# Altium schematic sheet FAN_CTRL.SchDoc
size A4
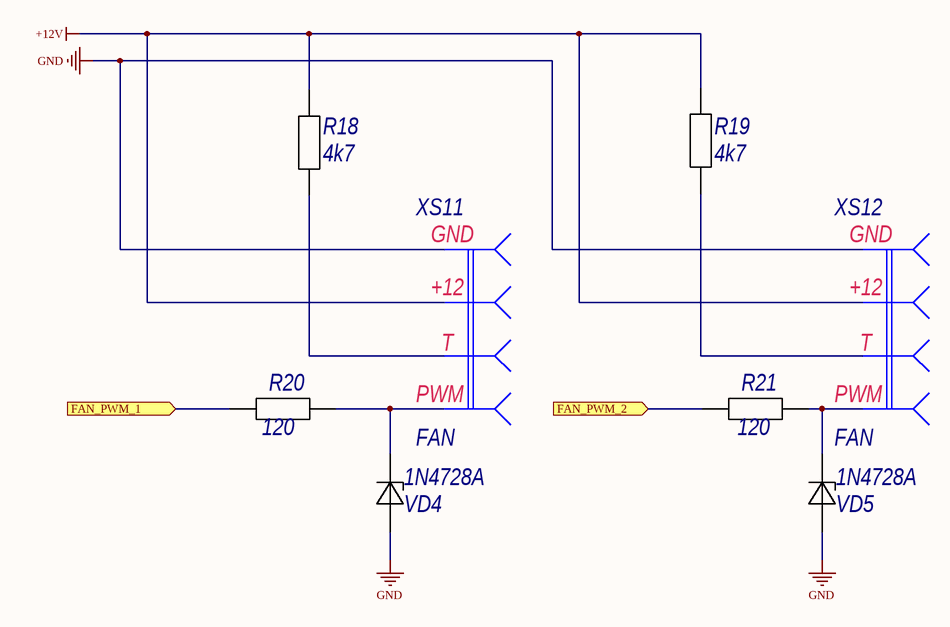
[diagram p0: FAN_CTRL.SchDoc]

## Parts
R18  4k7  [C0805R]
R19  4k7  [C0805R]
R20  120  [C0805R]
R21  120  [C0805R]
VD4  1N4728A  [DO-41]
VD5  1N4728A  [DO-41]
XS11  FAN  [PLD1X4]
XS12  FAN  [PLD1X4]

## Ports
FAN_PWM_1 (in), FAN_PWM_2 (in)

## Nets
+12V: R18.2 R19.2 XS11.2 XS12.2
GND: VD4.1(А) VD5.1(А) XS11.1 XS12.1
FAN_PWM_1: R20.1 ; port FAN_PWM_1
FAN_PWM_2: R21.1 ; port FAN_PWM_2
NetR18_1: R18.1 XS11.3
NetR19_1: R19.1 XS12.3
NetR20_2: R20.2 VD4.2(К) XS11.4
NetR21_2: R21.2 VD5.2(К) XS12.4

## Notes on the sheet
- (in symbol FAN_CON) GND; +12; T; PWM

## Library data of the parts
R18-R21 = RES_0805: Published: 24.03.2010; Publisher: Andrew Danich; Type: Резистор
VD4 VD5 = 1N4728A: Type: Стабилитрон; Published: 20.05.2013; Publisher: Andrew Danich
XS11 XS12 = FAN_CON: Value: Connector; Published: 07.03.2013; Publisher: Andrew Danich; Type: Розетка